# Altium schematic sheet 示波器原理图7.SchDoc
size A4
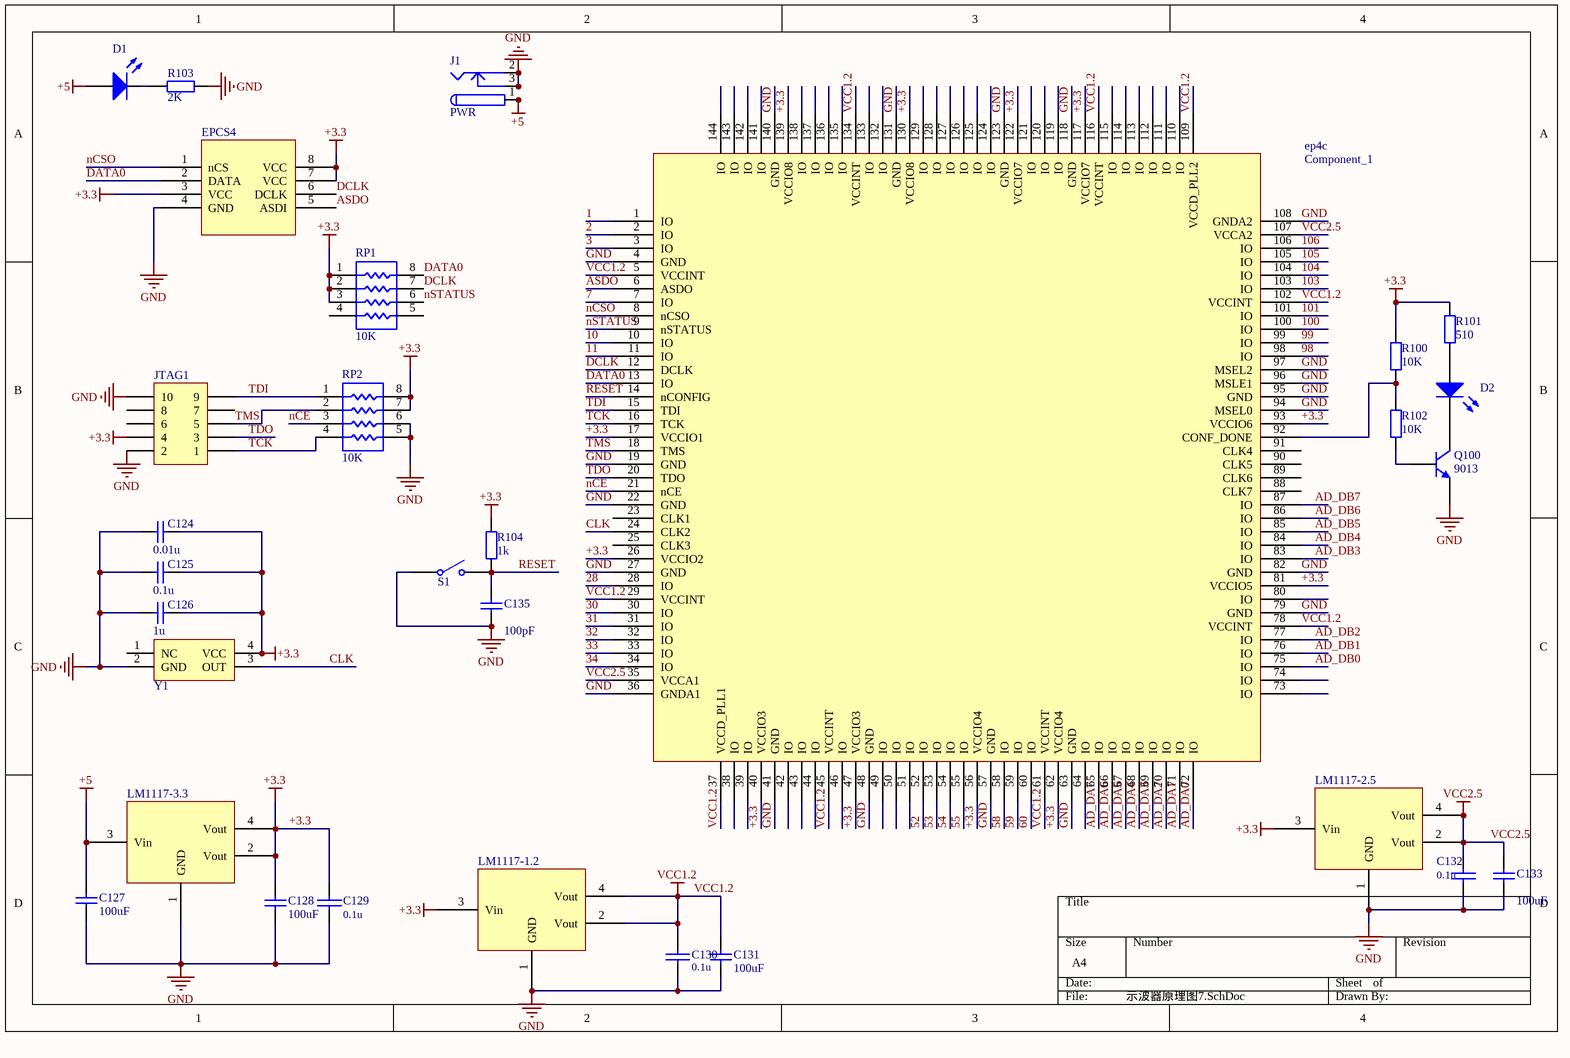
[diagram p0: 示波器原理图7.SchDoc]

## Parts
C124  value 0.01u  [PCBComponent_1]
C125  value 0.1u  [PCBComponent_1]
C126  value 1u  [PCBComponent_1]
C127  value 100uF  [C1206]
C128  value 100uF  [C1206]
C129  0.1u  [PCBComponent_1]
C130  0.1u  [PCBComponent_1]
C131  value 100uF  [C1206]
C132  0.1u  [PCBComponent_1]
C133  value 100uF  [C1206]
C135  value 100pF  [PCBComponent_1]
D1  LED0  [PCBComponent_1]  (value not drawn)
D2  LED0  [PCBComponent_1]  (value not drawn)
ep4c  Component_1  [PCBComponent_1]
EPCS4  (no value)  [PCBComponent_1]
J1  PWR  [KLD-0202]
JTAG1  (no value)  [HDR2X5]
LM1117-1.2  (no value)  [PCBComponent_1]
LM1117-2.5  (no value)  [PCBComponent_1]
LM1117-3.3  (no value)  [PCBComponent_1]
Q100  9013  [PCBComponent_1]
R100  value 10K  [PCBComponent_1]  (hidden comment: Res2)
R101  value 510  [PCBComponent_1]  (hidden comment: Res2)
R102  value 10K  [PCBComponent_1]  (hidden comment: Res2)
R103  value 2K  [PCBComponent_1]  (hidden comment: Res2)
R104  value 1k  [PCBComponent_1]  (hidden comment: Res2)
RP1  value 10K  [PCBComponent_1]  (hidden comment: Res Pack)
RP2  value 10K  [PCBComponent_1]  (hidden comment: Res Pack)
S1  SW-SPST  [PCBComponent_1]  (value not drawn)
Y1  Active crystal  [PCBComponent_1]  (value not drawn)

## Nets
+3.3: C124.1 C125.1 C126.1 C128.2 C129.1 ep4c.17(VCCIO1) ep4c.26(VCCIO2) ep4c.40(VCCIO3) ep4c.47(VCCIO3) ep4c.56(VCCIO4) ep4c.62(VCCIO4) ep4c.81(VCCIO5) ep4c.93(VCCIO6) ep4c.117(VCCIO7) ep4c.122(VCCIO7) ep4c.130(VCCIO8) ep4c.139(VCCIO8) EPCS4.3(VCC) EPCS4.7(VCC) EPCS4.8(VCC) JTAG1.4 LM1117-1.2.3(Vin) LM1117-2.5.3(Vin) LM1117-3.3.2(Vout) LM1117-3.3.4(Vout) R100.1 R101.1 R104.2 RP1.1 RP1.2 RP1.3 RP2.7 RP2.8 Y1.4(VCC)
+5: C127.2 D1.1(A) J1.1 J1.1A J1.1B LM1117-3.3.3(Vin)
GND: C124.2 C125.2 C126.2 C127.1 C128.1 C129.2 C130.2 C131.1 C132.2 C133.1 C135.1 ep4c.4(GND) ep4c.19(GND) ep4c.22(GND) ep4c.27(GND) ep4c.36(GNDA1) ep4c.41(GND) ep4c.48(GND) ep4c.57(GND) ep4c.63(GND) ep4c.79(GND) ep4c.82(GND) ep4c.94(MSEL0) ep4c.95(GND) ep4c.96(MSLE1) ep4c.97(MSEL2) ep4c.108(GNDA2) ep4c.118(GND) ep4c.123(GND) ep4c.131(GND) ep4c.140(GND) EPCS4.4(GND) J1.2 J1.2A J1.2B J1.3 J1.3A J1.3B JTAG1.2 JTAG1.10 LM1117-1.2.1(GND) LM1117-2.5.1(GND) LM1117-3.3.1(GND) Q100.1(E) R103.2 RP2.5 RP2.6 S1.1(COMMON) Y1.2(GND)
VCC1.2: C130.1 C131.2 ep4c.5(VCCINT) ep4c.29(VCCINT) ep4c.37(VCCD_PLL1) ep4c.45(VCCINT) ep4c.61(VCCINT) ep4c.78(VCCINT) ep4c.102(VCCINT) ep4c.109(VCCD_PLL2) ep4c.116(VCCINT) ep4c.134(VCCINT) LM1117-1.2.2(Vout) LM1117-1.2.4(Vout)
VCC2.5: C132.1 C133.2 ep4c.35(VCCA1) ep4c.107(VCCA2) LM1117-2.5.2(Vout) LM1117-2.5.4(Vout)
1: ep4c.1(IO)
2: ep4c.2(IO)
3: ep4c.3(IO)
7: ep4c.7(IO)
10: ep4c.10(IO)
11: ep4c.11(IO)
28: ep4c.28(IO)
30: ep4c.30(IO)
31: ep4c.31(IO)
32: ep4c.32(IO)
33: ep4c.33(IO)
34: ep4c.34(IO)
52: ep4c.52(IO)
53: ep4c.53(IO)
54: ep4c.54(IO)
55: ep4c.55(IO)
58: ep4c.58(IO)
59: ep4c.59(IO)
60: ep4c.60(IO)
98: ep4c.98(IO)
99: ep4c.99(IO)
100: ep4c.100(IO)
101: ep4c.101(IO)
103: ep4c.103(IO)
104: ep4c.104(IO)
105: ep4c.105(IO)
106: ep4c.106(IO)
AD_DA0: ep4c.72(IO)
AD_DA1: ep4c.71(IO)
AD_DA2: ep4c.70(IO)
AD_DA3: ep4c.69(IO)
AD_DA4: ep4c.68(IO)
AD_DA5: ep4c.67(IO)
AD_DA6: ep4c.66(IO)
AD_DA7: ep4c.65(IO)
AD_DB0: ep4c.75(IO)
AD_DB1: ep4c.76(IO)
AD_DB2: ep4c.77(IO)
AD_DB3: ep4c.83(IO)
AD_DB4: ep4c.84(IO)
AD_DB5: ep4c.85(IO)
AD_DB6: ep4c.86(IO)
AD_DB7: ep4c.87(IO)
ASDO: ep4c.6(ASDO) EPCS4.5(ASDI)
CLK: ep4c.24(CLK2) Y1.3(OUT)
DATA0: ep4c.13(IO) EPCS4.2(DATA) RP1.8
DCLK: ep4c.12(DCLK) EPCS4.6(DCLK) RP1.7
nCE: ep4c.21(nCE) RP2.3
nCSO: ep4c.8(nCSO) EPCS4.1(nCS)
nSTATUS: ep4c.9(nSTATUS) RP1.6
RESET: C135.2 ep4c.14(nCONFIG) R104.1 S1.2(NO)
TCK: ep4c.16(TCK) JTAG1.1 RP2.4
TDI: ep4c.15(TDI) JTAG1.9 RP2.1
TDO: ep4c.20(TDO) JTAG1.3
TMS: ep4c.18(TMS) JTAG1.5 RP2.2
NetD1_2: D1.2(K) R103.1
NetD2_1: D2.1(A) R101.2
NetD2_2: D2.2(K) Q100.3(C)
Netep4c_92: ep4c.92(CONF_DONE) R100.2 R102.1
NetQ100_2: Q100.2(B) R102.2

Not connected (* = marked no-connect by the designer): ep4c 23(CLK1) 25(CLK3) 38(IO) 39(IO) 42(IO) 43(IO) 44(IO) 46(IO) 49(IO) 50(IO) 51(IO) 64(IO) 73(IO) 74(IO) 80(IO) 88(CLK7) 89(CLK6) 90(CLK5) 91(CLK4) 110(IO) 111(IO) 112(IO) 113(IO) 114(IO) 115(IO) 119(IO) 120(IO) 121(IO) 124(IO) 125(IO) 126(IO) 127(IO) 128(IO) 129(IO) 132(IO) 133(IO) 135(IO) 136(IO) 137(IO) 138(IO) 141(IO) 142(IO) 143(IO) 144(IO); JTAG1 6 7 8; RP1 4 5; Y1 1(NC)

## Library data of the parts
C124-C128 C131 C133 C135 = Cap Semi: Capacitor (Semiconductor SIM Model); Published: 8-Jun-2000; LatestRevisionDate: 17-Jul-2002; LatestRevisionNote: Re-released for DXP Platform.; PackageReference: C1206; Publisher: Altium Limited
C129 C130 C132 = CAP: Capacitor
D1 D2 = LED0: Typical INFRARED GaAs LED; Published: 8-Jun-2000; LatestRevisionDate: 08-Jul-2005; LatestRevisionNote: Mech Layer 1 removed.; PackageReference: LED-0; Publisher: Altium Limited
EPCS4 LM1117-1.2 LM1117-2.5 LM1117-3.3 = Component_1
J1 = PWR2.5: Low Voltage Power Supply Connector; Published: 17-Dec-2003; DatasheetDocument: 09-May-2002; Publisher: Altium Limited; ComponentLink1Description: Manufacturer Link; ComponentLink1URL: http://domino.kycon.com/internet/Products.html
JTAG1 = Header 5X2: Header, 5-Pin, Dual row; LatestRevisionDate: 17-Jul-2002; LatestRevisionNote: Re-released for DXP Platform.; Publisher: Altium Limited
Q100 = 2N3904: NPN General Purpose Amplifier; Published: 8-Jun-2000; LatestRevisionDate: 15-Jan-2003; LatestRevisionNote: PCB Footprint 'BCY-W3/D4.7' replaced; DatasheetDocument: 1997; PackageDocument: Sep-1998; PackageReference: TO-92A; Publisher: Altium Limited; Code_JEDEC: TO-92A; ComponentLink1Description: Manufacturer Link; ComponentLink1URL: http://www.fairchildsemi.com/; ComponentLink2Description: Datasheet; ComponentLink2URL: http://www.fairchildsemi.com/ds/2N%2F2N3904.pdf
R100-R104 = Res2: Resistor; Published: 8-Jun-2000; LatestRevisionDate: 17-Jul-2002; LatestRevisionNote: Re-released for DXP Platform.; PackageReference: AXIAL-0.4; Publisher: Altium Limited
RP1 RP2 = Res Pack3: Isolated Resistor Network; Published: 24-Mar-1999; LatestRevisionDate: 17-Jul-2002; LatestRevisionNote: Re-released for DXP Platform.; PackageReference: SO-8; Publisher: Altium Limited
S1 = SW-SPST_1: Single-Pole, Single-Throw Switch; Published: 24-Mar-1999; LatestRevisionDate: 17-Jul-2002; LatestRevisionNote: Re-released for DXP Platform.; PackageReference: SPST-2; Publisher: Altium Limited